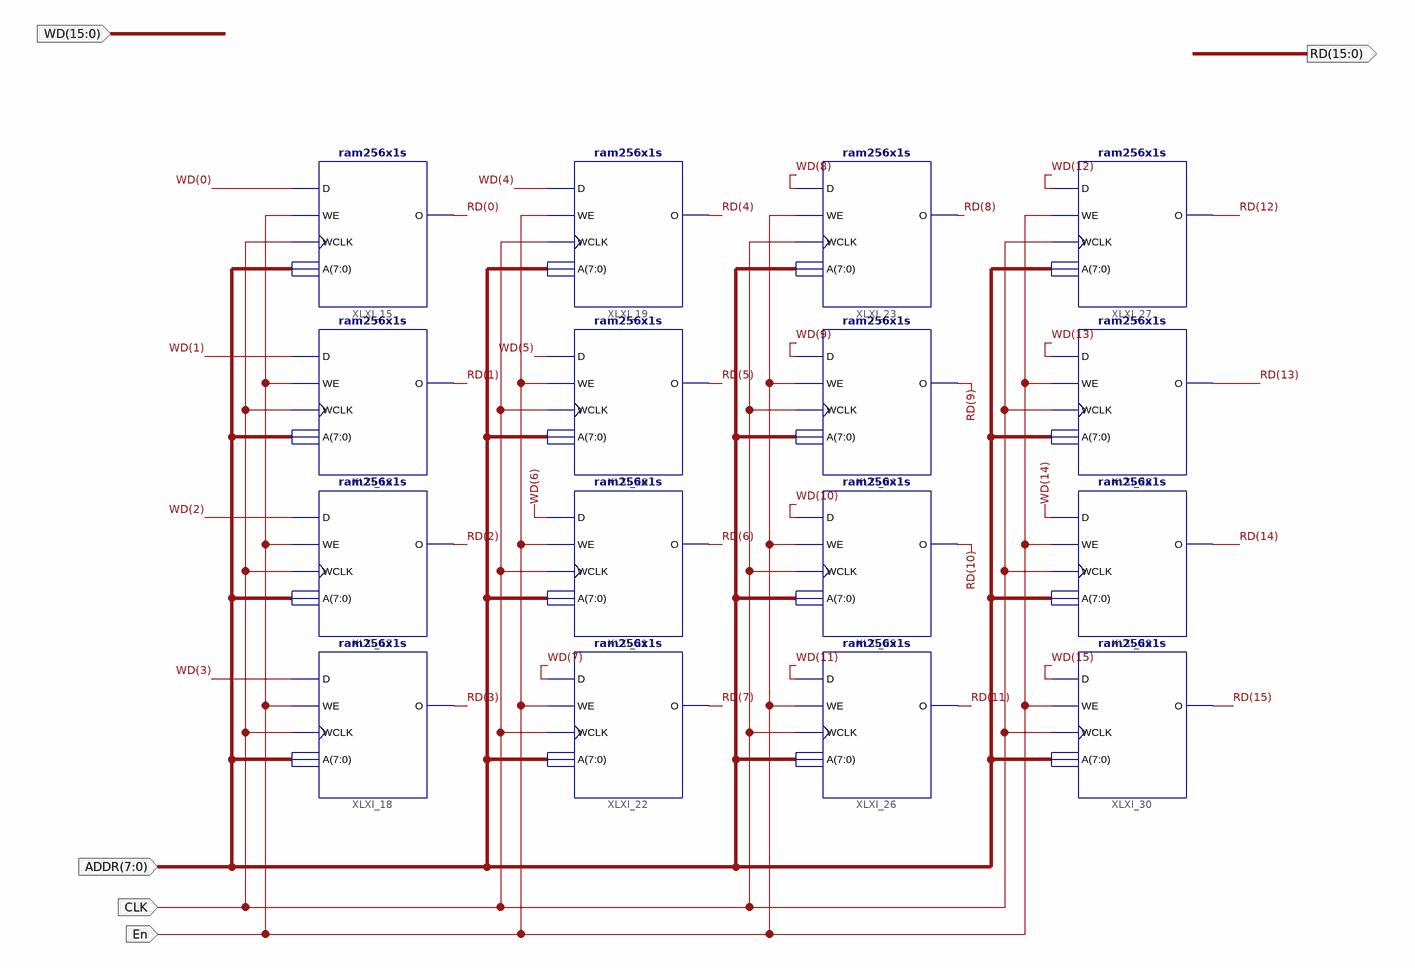
[diagram p0: schematic sheet 1]
// Xilinx ISE schematic Memory_256x16.sch (artix7) as structural Verilog: 16 symbols, 5 ports
module Memory_256x16 (
  input  [7:0] ADDR,
  input  En,
  input  CLK,
  input  [15:0] WD,
  output [15:0] RD
);

  ram256x1s XLXI_15 (.WE(En), .WCLK(CLK), .D(WD[0]), .O(RD[0]), .A(ADDR));
  ram256x1s XLXI_16 (.WE(En), .WCLK(CLK), .D(WD[1]), .O(RD[1]), .A(ADDR));
  ram256x1s XLXI_17 (.WE(En), .WCLK(CLK), .D(WD[2]), .O(RD[2]), .A(ADDR));
  ram256x1s XLXI_18 (.WE(En), .WCLK(CLK), .D(WD[3]), .O(RD[3]), .A(ADDR));
  ram256x1s XLXI_19 (.WE(En), .WCLK(CLK), .D(WD[4]), .O(RD[4]), .A(ADDR));
  ram256x1s XLXI_20 (.WE(En), .WCLK(CLK), .D(WD[5]), .O(RD[5]), .A(ADDR));
  ram256x1s XLXI_21 (.WE(En), .WCLK(CLK), .D(WD[6]), .O(RD[6]), .A(ADDR));
  ram256x1s XLXI_22 (.WE(En), .WCLK(CLK), .D(WD[7]), .O(RD[7]), .A(ADDR));
  ram256x1s XLXI_23 (.WE(En), .WCLK(CLK), .D(WD[8]), .O(RD[8]), .A(ADDR));
  ram256x1s XLXI_24 (.WE(En), .WCLK(CLK), .D(WD[9]), .O(RD[9]), .A(ADDR));
  ram256x1s XLXI_25 (.WE(En), .WCLK(CLK), .D(WD[10]), .O(RD[10]), .A(ADDR));
  ram256x1s XLXI_26 (.WE(En), .WCLK(CLK), .D(WD[11]), .O(RD[11]), .A(ADDR));
  ram256x1s XLXI_27 (.WE(En), .WCLK(CLK), .D(WD[12]), .O(RD[12]), .A(ADDR));
  ram256x1s XLXI_28 (.WE(En), .WCLK(CLK), .D(WD[13]), .O(RD[13]), .A(ADDR));
  ram256x1s XLXI_29 (.WE(En), .WCLK(CLK), .D(WD[14]), .O(RD[14]), .A(ADDR));
  ram256x1s XLXI_30 (.WE(En), .WCLK(CLK), .D(WD[15]), .O(RD[15]), .A(ADDR));
endmodule
